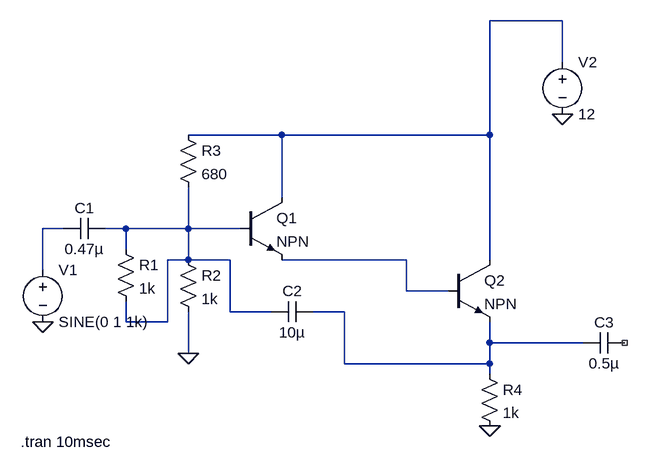
[diagram p0: schematic exp_7_ii_wb_electro.asc]
exp_7_ii_wb_electro.asc, the LTspice schematic file:
Version 4
SHEET 1 952 680
WIRE 816 -208 704 -208
WIRE 816 -144 816 -208
WIRE 384 -32 240 -32
WIRE 704 -32 704 -208
WIRE 704 -32 384 -32
WIRE 384 64 384 -32
WIRE 48 112 16 112
WIRE 144 112 112 112
WIRE 240 112 240 48
WIRE 240 112 144 112
WIRE 320 112 240 112
WIRE 144 144 144 112
WIRE 240 160 240 112
WIRE 240 160 208 160
WIRE 304 160 240 160
WIRE 576 160 384 160
WIRE 704 160 704 -32
WIRE 16 176 16 112
WIRE 576 208 576 160
WIRE 640 208 576 208
WIRE 304 240 304 160
WIRE 368 240 304 240
WIRE 480 240 432 240
WIRE 144 256 144 224
WIRE 208 256 208 160
WIRE 208 256 144 256
WIRE 704 288 704 256
WIRE 848 288 704 288
WIRE 240 304 240 240
WIRE 480 320 480 240
WIRE 704 320 704 288
WIRE 704 320 480 320
WIRE 704 336 704 320
FLAG 240 304 0
FLAG 816 -64 0
FLAG 16 256 0
FLAG 704 416 0
SYMBOL voltage 16 160 R0
WINDOW 123 0 0 Left 0
WINDOW 39 0 0 Left 0
SYMATTR InstName V1
SYMATTR Value SINE(0 1 1k)
SYMBOL cap 112 96 R90
WINDOW 0 0 32 VBottom 2
WINDOW 3 32 32 VTop 2
SYMATTR InstName C1
SYMATTR Value 0.47µ
SYMBOL res 128 128 R0
SYMATTR InstName R1
SYMATTR Value 1k
SYMBOL res 224 144 R0
SYMATTR InstName R2
SYMATTR Value 1k
SYMBOL res 224 -48 R0
SYMATTR InstName R3
SYMATTR Value 680
SYMBOL npn 320 64 R0
SYMATTR InstName Q1
SYMBOL npn 640 160 R0
SYMATTR InstName Q2
SYMBOL cap 432 224 R90
WINDOW 0 0 32 VBottom 2
WINDOW 3 32 32 VTop 2
SYMATTR InstName C2
SYMATTR Value 10µ
SYMBOL res 688 320 R0
SYMATTR InstName R4
SYMATTR Value 1k
SYMBOL cap 912 272 R90
WINDOW 0 0 32 VBottom 2
WINDOW 3 32 32 VTop 2
SYMATTR InstName C3
SYMATTR Value 0.5µ
SYMBOL voltage 816 -160 R0
WINDOW 123 0 0 Left 0
WINDOW 39 0 0 Left 0
SYMATTR InstName V2
SYMATTR Value 12
TEXT -18 440 Left 2 !.tran 10msec

The netlist it stands for:
* exp_7_ii_wb_electro.asc
V1 N002 0 SINE(0 1 1k)
C1 N003 N002 0.47µ
R1 N003 N003 1k
R2 N003 0 1k
R3 N001 N003 680
Q1 N001 N003 N004 0 NPN
Q2 N001 N004 N005 0 NPN
C2 N005 N003 10µ
R4 N005 0 1k
C3 NC_01 N005 0.5µ
V2 N001 0 12
.model NPN NPN
.model PNP PNP
.lib standard.bjt
.tran 10msec
.backanno
.end